# EAGLE schematic RCTank (EAGLE 7.6.0)
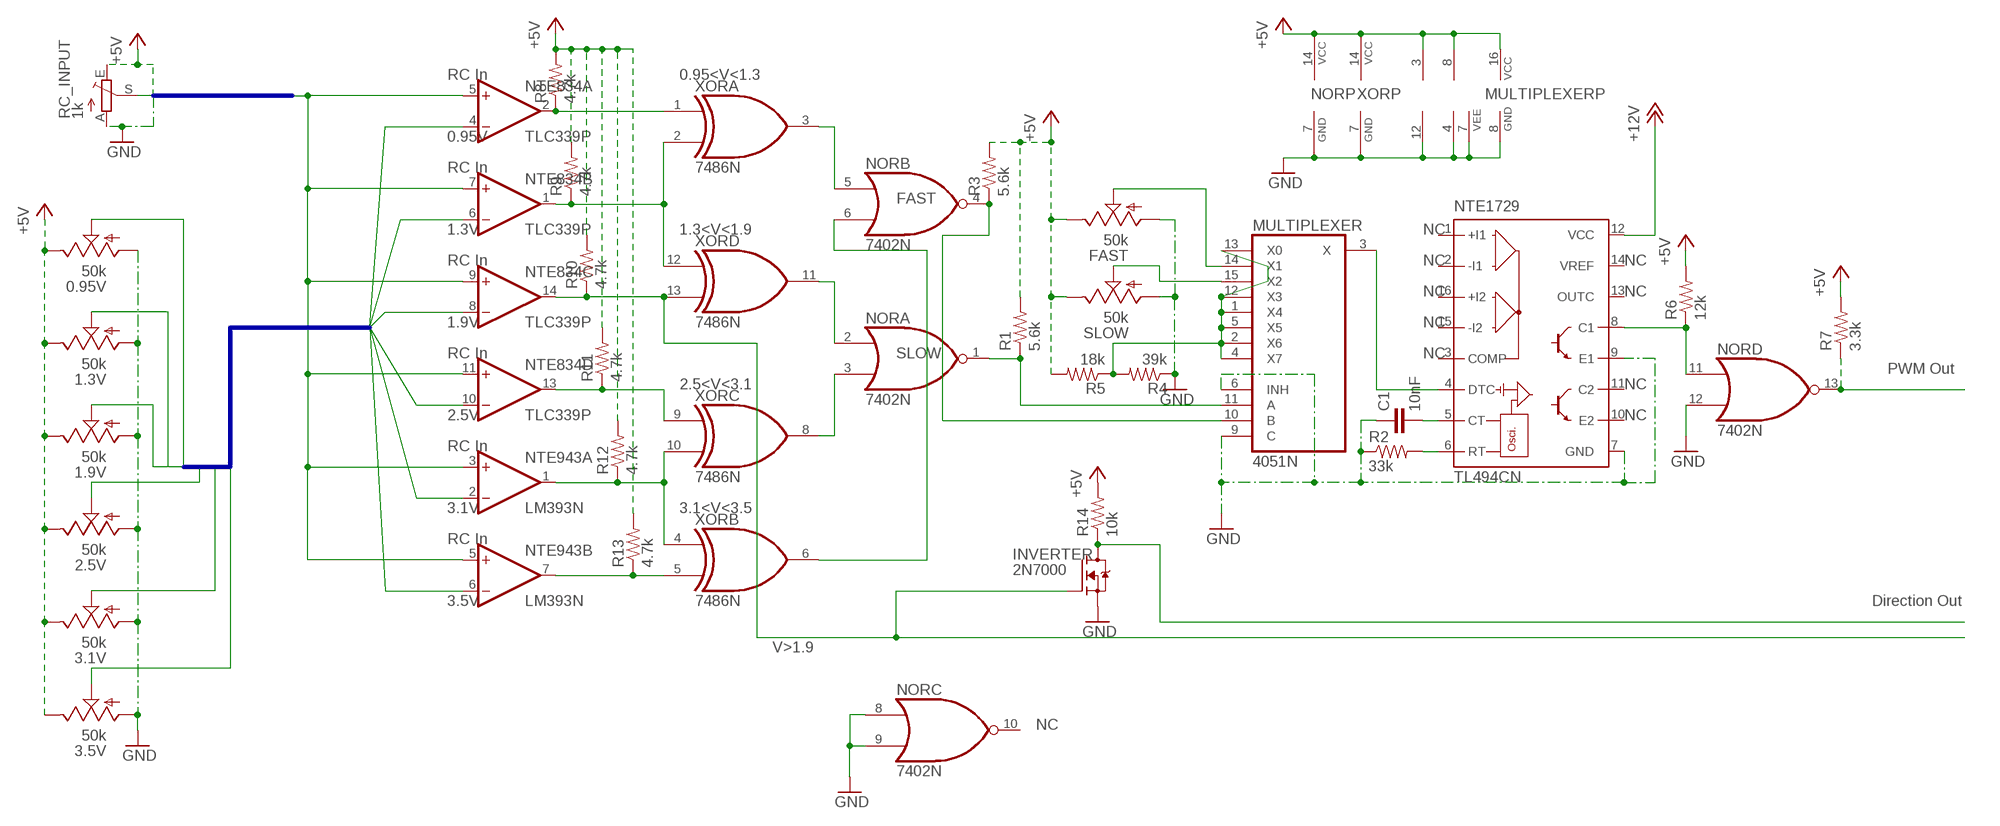
[diagram p0: schematic, sheet 1]

## Parts
0.95V  50k  TRIM_US-S64W  [S64W]
1.3V  50k  TRIM_US-S64W  [S64W]
1.9V  50k  TRIM_US-S64W  [S64W]
2.5V  50k  TRIM_US-S64W  [S64W]
3.1V  50k  TRIM_US-S64W  [S64W]
3.5V  50k  TRIM_US-S64W  [S64W]
C1  10nF  C2.5/5  [C2.5-5]
FAST  50k  TRIM_US-S64W  [S64W]
INVERTER  2N7000  [TO92-]
MULTIPLEXER  4051N  [DIL16]
NOR  7402N  [DIL14]
NTE834  TLC339P  [DIL14]
NTE943  LM393N  [DIL08]
NTE1729  TL494CN  [DIL16]
R1  5.6k  R-US_0204/7  [0204/7]
R2  33k  R-US_0204/7  [0204/7]
R3  5.6k  R-US_0204/7  [0204/7]
R4  39k  R-US_0204/7  [0204/7]
R5  18k  R-US_0204/7  [0204/7]
R6  12k  R-US_0204/7  [0204/7]
R7  3.3k  R-US_0204/7  [0204/7]
R8  4.7k  R-US_0204/7  [0204/7]
R9  4.7k  R-US_0204/7  [0204/7]
R10  4.7k  R-US_0204/7  [0204/7]
R11  4.7k  R-US_0204/7  [0204/7]
R12  4.7k  R-US_0204/7  [0204/7]
R13  4.7k  R-US_0204/7  [0204/7]
R14  10k  R-US_0204/7  [0204/7]
RC_INPUT  1k  TRIM_EU-B25V  [B25V]
SLOW  50k  TRIM_US-S64W  [S64W]
XOR  7486N  [DIL14]

## Nets
0.95V: 0.95V.S NTE834.4(A:-IN)
1.3V: 1.3V.S NTE834.6(B:-IN)
1.9V: 1.9V.S NTE834.8(C:-IN)
2.5V: 2.5V.S NTE834.10(D:-IN)
3.1V: 3.1V.S NTE943.2(A:-IN)
3.5V: 3.5V.S NTE943.6(B:-IN)
+5V: 0.95V.E 1.3V.E 1.9V.E 2.5V.E 3.1V.E 3.5V.E FAST.E MULTIPLEXER.16(VCC) NOR.14(P:VCC) NTE834.3(P:V+) NTE943.8(P:V+) R1.2 R3.2 R5.2 R6.2 R7.2 R8.2 R9.2 R10.2 R11.2 R12.2 R13.2 R14.2 RC_INPUT.E SLOW.E XOR.14(P:VCC)
+12V: NTE1729.12(VCC)
GND: 0.95V.A 1.3V.A 1.9V.A 2.5V.A 3.1V.A 3.5V.A C1.1 FAST.A INVERTER.3(S) MULTIPLEXER.6(INH) MULTIPLEXER.7(VEE) MULTIPLEXER.8(GND) MULTIPLEXER.9(C) NOR.7(P:GND) NOR.8(C:I0) NOR.9(C:I1) NOR.12(D:I1) NTE834.12(P:V-) NTE943.4(P:V-) NTE1729.7(GND) NTE1729.9(E1) R2.1 R4.1 RC_INPUT.A SLOW.A XOR.7(P:GND)
N$1: NOR.11(D:I0) NTE1729.8(C1) R6.1
N$2: NOR.13(D:O) R7.1
N$3: MULTIPLEXER.10(B) NOR.4(B:O) R3.1
N$4: INVERTER.1(D) R14.1
N$5: FAST.S MULTIPLEXER.14(X1)
N$6: MULTIPLEXER.15(X2) SLOW.S
N$8: NOR.5(B:I0) XOR.3(A:O)
N$9: NOR.2(A:I0) XOR.11(D:O)
N$10: NTE834.2(A:OUT) R8.1 XOR.1(A:I0)
N$11: NTE834.1(B:OUT) R9.1 XOR.2(A:I1) XOR.12(D:I0)
N$12: MULTIPLEXER.1(X4) MULTIPLEXER.2(X6) MULTIPLEXER.4(X7) MULTIPLEXER.5(X5) MULTIPLEXER.12(X3) MULTIPLEXER.13(X0) R4.2 R5.1
N$13: NTE834.13(D:OUT) R11.1 XOR.9(C:I0)
N$14: NTE943.1(A:OUT) R12.1 XOR.4(B:I0) XOR.10(C:I1)
N$15: NTE943.7(B:OUT) R13.1 XOR.5(B:I1)
N$16: NOR.3(A:I1) XOR.8(C:O)
N$17: INVERTER.2(G) NTE834.14(C:OUT) R10.1 XOR.13(D:I1)
N$18: MULTIPLEXER.11(A) NOR.1(A:O) R1.1
N$19: NOR.6(B:I1) XOR.6(B:O)
N$21: C1.2 NTE1729.5(CT)
N$22: NTE1729.6(RT) R2.2
N$25: MULTIPLEXER.3(X) NTE1729.4(DTC)
SIG: NTE834.5(A:+IN) NTE834.7(B:+IN) NTE834.9(C:+IN) NTE834.11(D:+IN) NTE943.3(A:+IN) NTE943.5(B:+IN) RC_INPUT.S
Unconnected: NOR.10(C:O) NTE1729.1(+I1) NTE1729.2(-I1) NTE1729.3(COMP) NTE1729.10(E2) NTE1729.11(C2) NTE1729.13(OUTC) NTE1729.14(VREF) NTE1729.15(-I2) NTE1729.16(+I2)

## Buses
POT1:+5V,SIG,GND
POTS:+5V,GND,0.95V,1.3V,1.9V,2.5V,3.1V,3.5V

## Notes on the sheet
- RC In | 0.95<V<1.3
- 0.95V
- RC In
- FAST
- 1.3V | 1.3<V<1.9 | NC
- RC In | NC | NC
- NC | NC
- 1.9V | NC
- RC In | SLOW | NC
- PWM Out
- 2.5<V<3.1 | NC
- 2.5V | NC
- RC In
- 3.1V | 3.1<V<3.5
- RC In
- 3.5V | Direction Out
- V>1.9
- NC

## Library data of the parts
0.95V 1.3V 1.9V 2.5V 3.1V 3.5V FAST SLOW = pot:TRIM_US-: POTENTIOMETER
C1 = capacitor-wima:C: CAPACITOR naming: grid - package width
INVERTER = transistor-fet:2N7000: 2n7000 N-Channel Mosfet, 60V/200mA
MULTIPLEXER = 40xx:4051: 8-channel ANALOG MULTIPLEXER
NOR = 74xx-us:74*02: Quad 2-input NOR gate
NTE834 = linear:TLC339: COMPARATOR
NTE943 = linear:LM393: COMPARATOR
NTE1729 = linear:TL494*: SWITCHMODE Pulse Width Modulation Control Circuit NCV494B http://onsemi.com tl494-d.pdf
R1-R14 = resistor:R-US_: RESISTOR, American symbol
RC_INPUT = pot:TRIM_EU-: POTENTIOMETER
XOR = 74xx-us:74*86: Quad 2-input EXCLUSIV-OR (XOR) gate